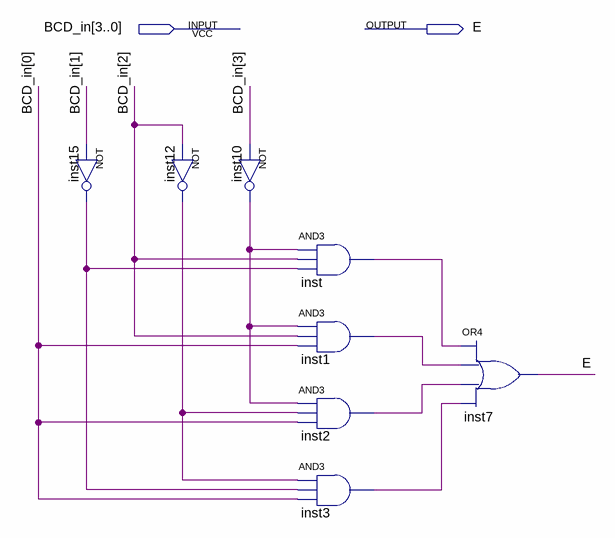
[diagram p0: schematic sheet]
// Quartus schematic E.bdf as structural Verilog: 8 symbols, 2 pins
module E (
  input  [3:0] BCD_in,
  output E
);

  wire inst1_out, inst2_out, inst3_out, inst10_out, inst12_out, inst15_out, inst_out;

  not inst15 (inst15_out, BCD_in[1]);
  not inst12 (inst12_out, BCD_in[2]);
  not inst10 (inst10_out, BCD_in[3]);
  and inst (inst_out, inst10_out, BCD_in[2], inst15_out);
  and inst1 (inst1_out, inst10_out, BCD_in[2], BCD_in[0]);
  and inst2 (inst2_out, inst10_out, inst12_out, BCD_in[0]);
  and inst3 (inst3_out, inst12_out, inst15_out, BCD_in[0]);
  or inst7 (E, inst_out, inst1_out, inst2_out, inst3_out);
endmodule
